# Altium schematic sheet Sheet_1_2026-06-06 (1).schdoc
size 44 x 28 mm
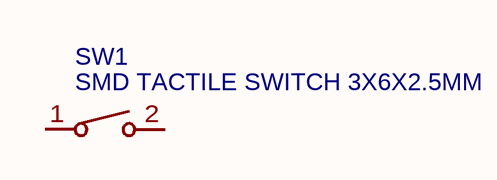
[diagram p0: Sheet_1_2026-06-06 (1).schdoc]

## Parts
SW1  SMD TACTILE SWITCH 3X6X2.5MM  [SW-SMD_L6.0-W3.5-LS8.0]

## Nets

Not connected (* = marked no-connect by the designer): SW1 1 2

## Library data of the parts
SW1 = SMD TACTILE SWITCH 3X6X2.5MM: Manufacturer: USAKRO; Manufacturer Part: UK-B0240-R-250; Contributor: LCSC; Supplier: LCSC; Supplier Part: C556660; spicePre: S; spiceSymbolName: SMD TACTILE SWITCH 3X6X2.5MM